# EAGLE schematic Untitled (EAGLE 7.2.0)
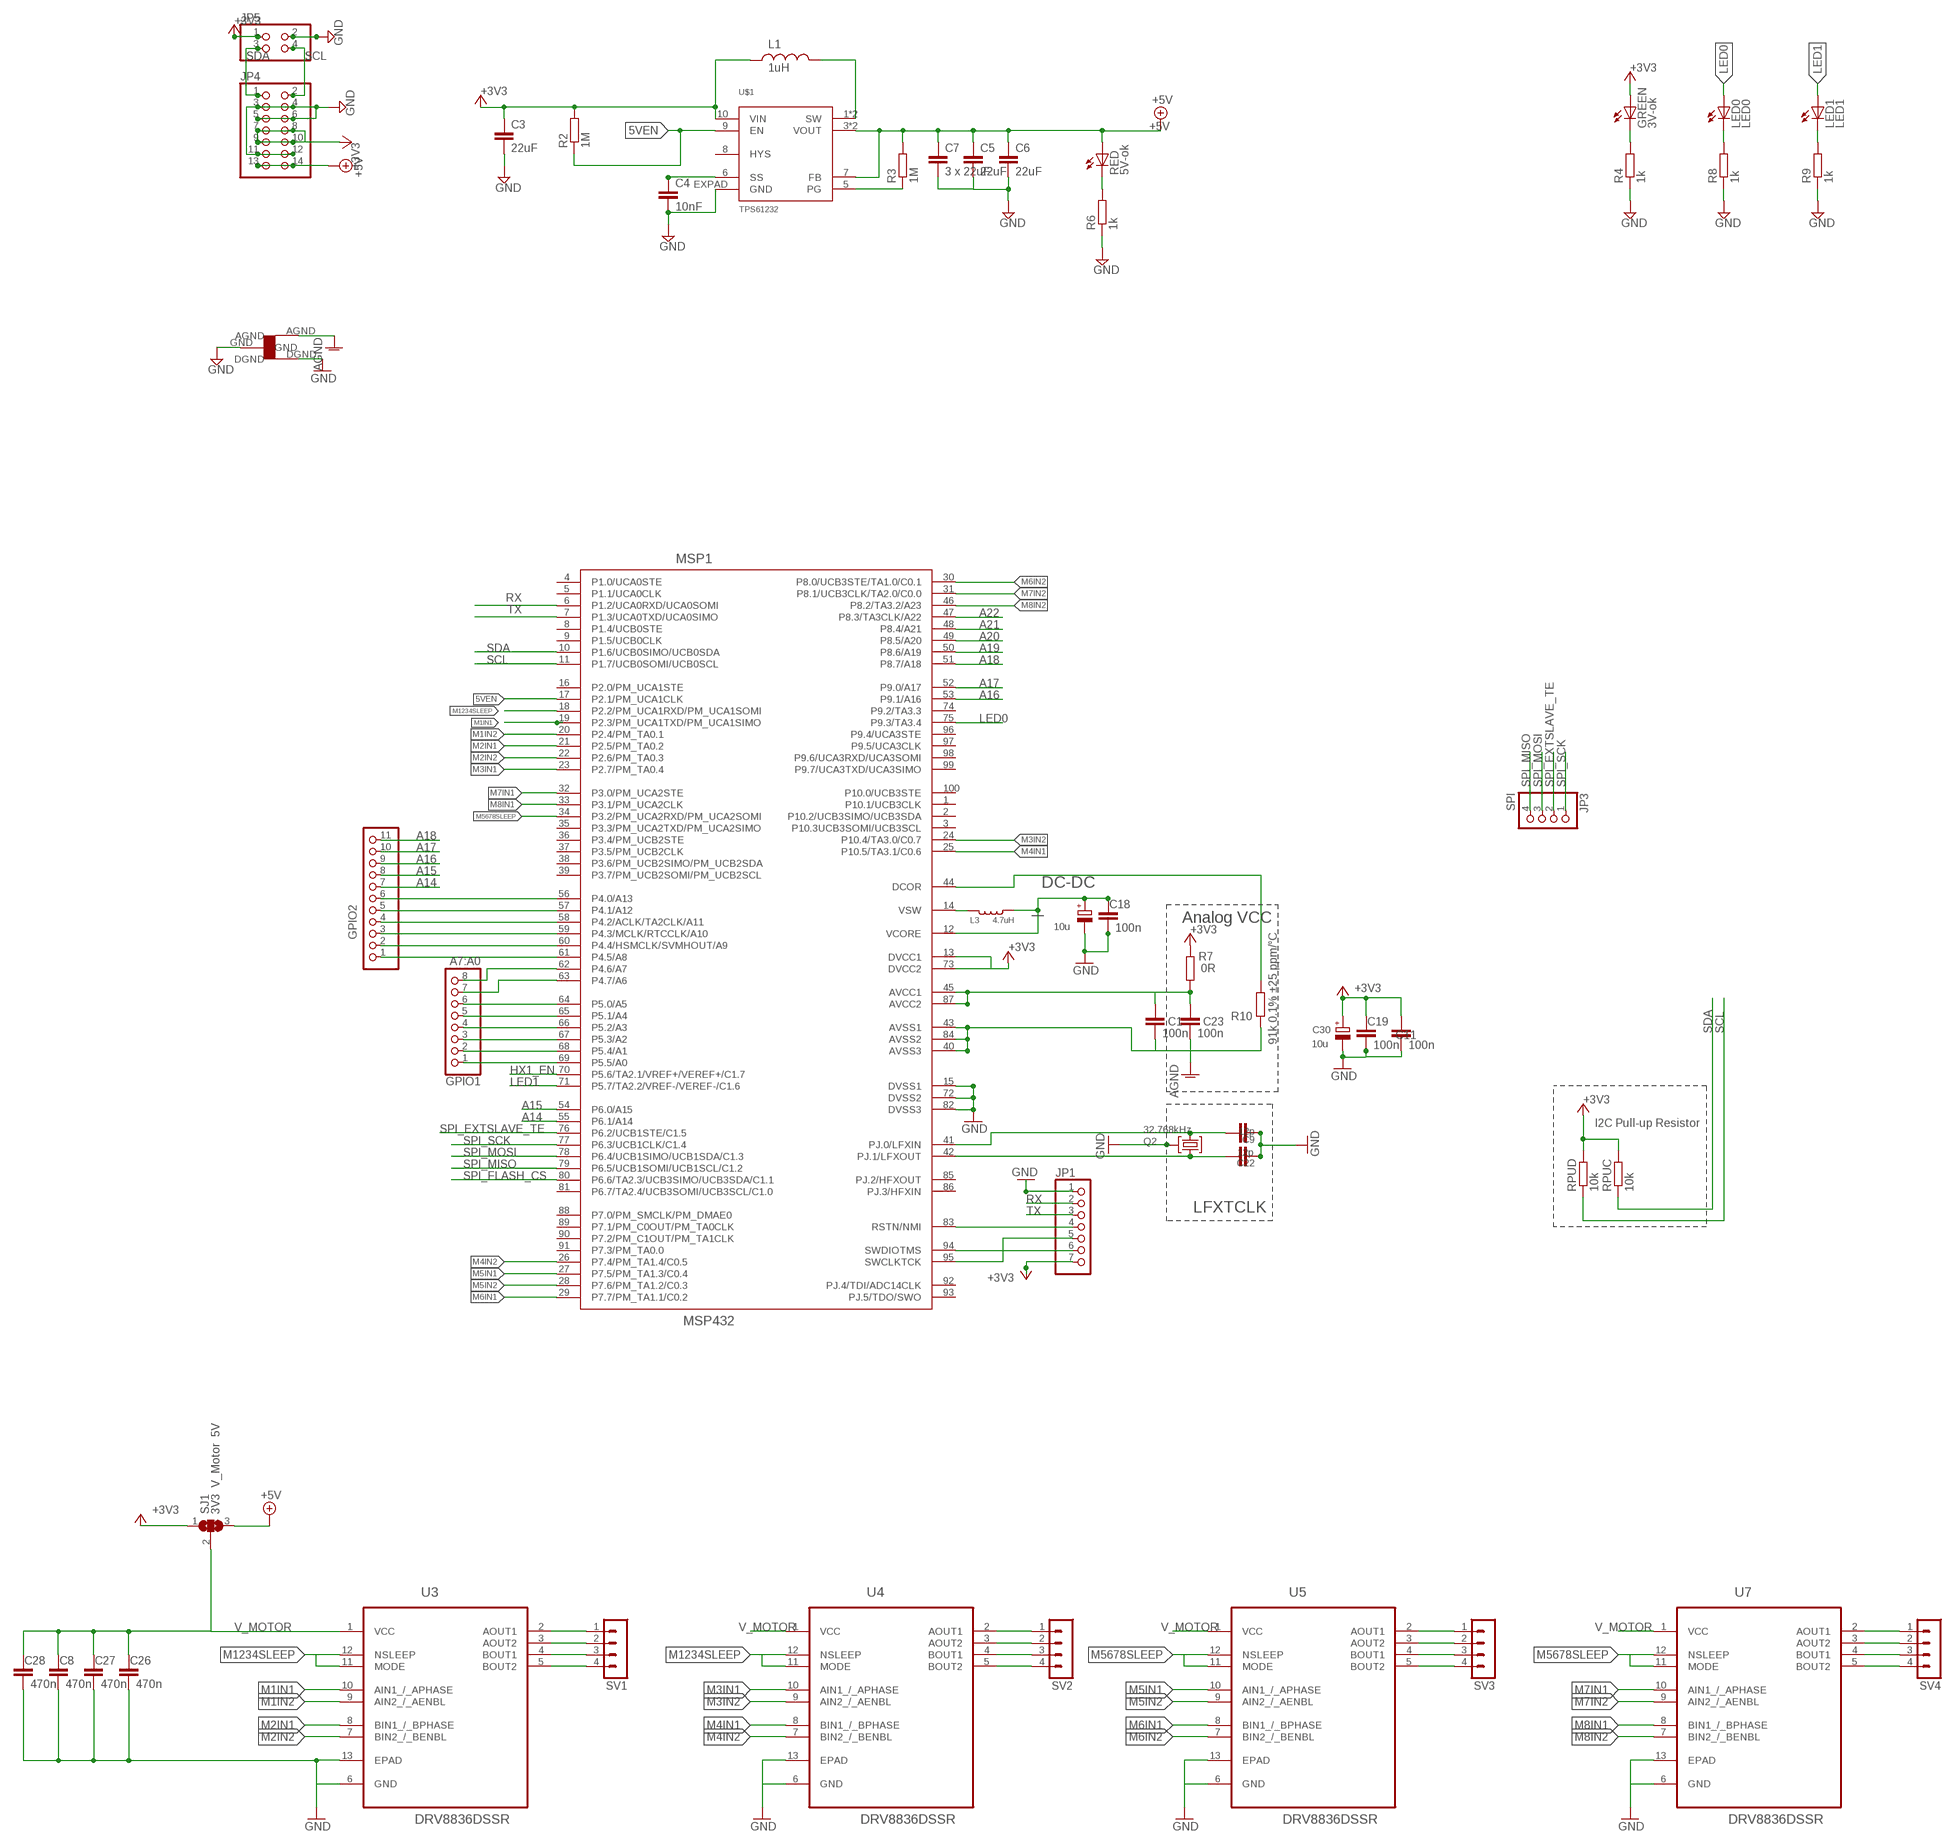
[diagram p0: schematic, sheet 1, part 1 of 2]
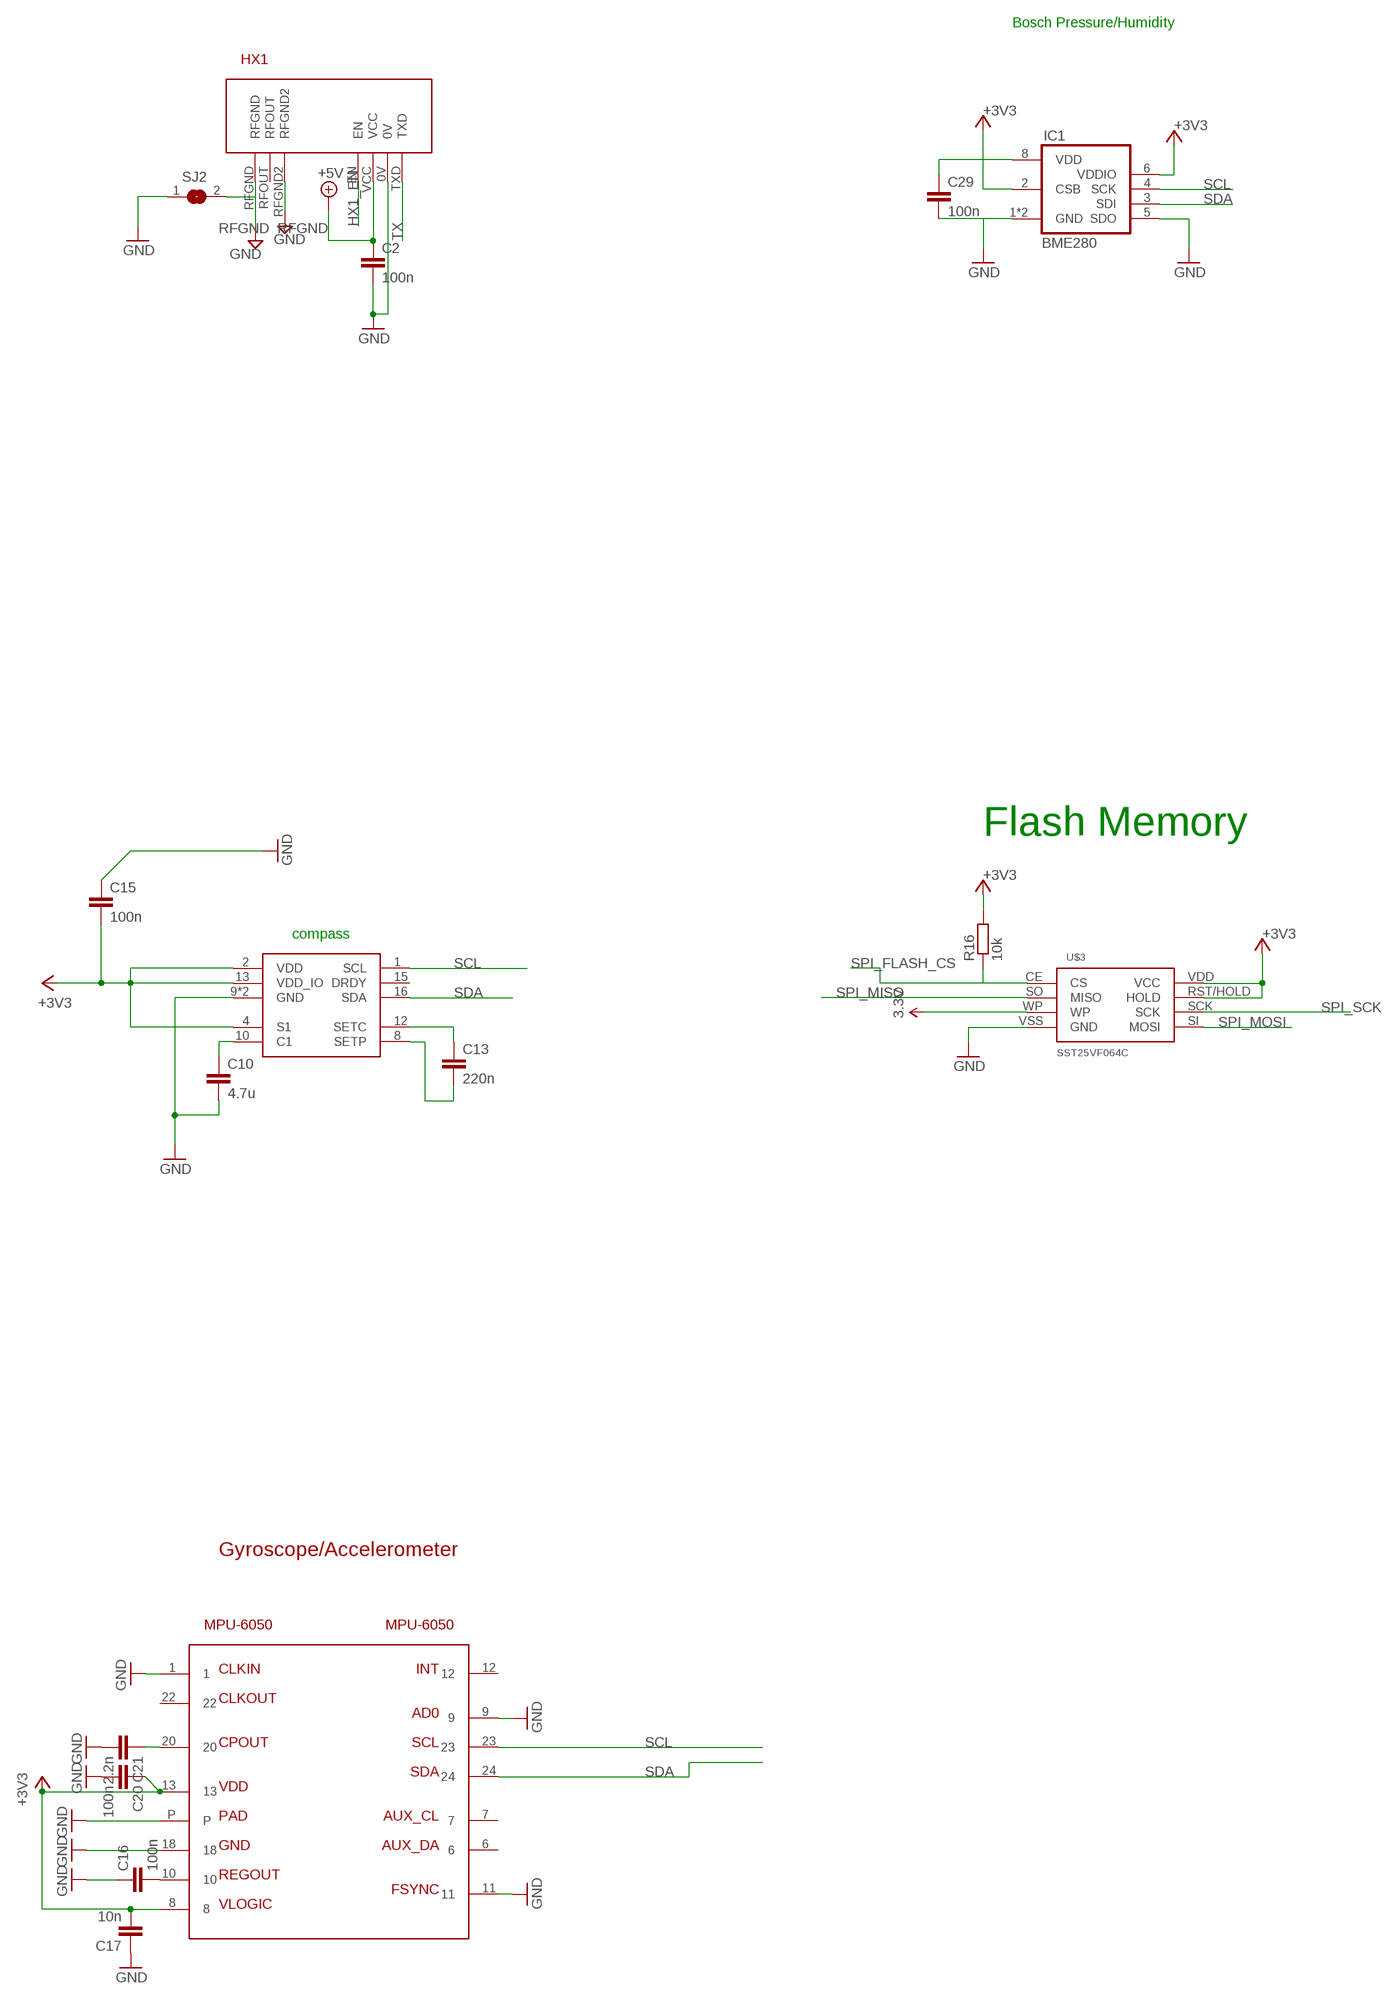
[diagram p1: schematic, sheet 1, part 2 of 2]

## Parts
C1  100n  C-EUC0402  [C0402]
C2  100n  C-EUC0603  [C0603]
C3  22uF  C-EUC0603  [C0603]
C4  10nF  C-EUC0603  [C0603]
C5  22uF  C-EUC0603  [C0603]
C6  22uF  C-EUC0603  [C0603]
C7  3 x 22uF  C-EUC0603  [C0603]
C8  470n  C-EUC0603  [C0603]
C9  12p  C-EUC0402  [C0402]
C10  4.7u  C-EUC0603  [C0603]
C11  100n  C-EUC0603  [C0603]
C13  220n  C-EUC0603  [C0603]
C15  100n  C-EUC0603  [C0603]
C16  100n  C-EUC0603  [C0603]
C17  10n  C-EUC0603  [C0603]
C18  100n  C-EUC0603  [C0603]
C19  100n  C-EUC0603  [C0603]
C20  100n  C-EUC0603  [C0603]
C21  2.2n  C-EUC0603  [C0603]
C22  12p  C-EUC0402  [C0402]
C23  100n  C-EUC0402  [C0402]
C25  10u  CPOL-EUA/3216-18R  [A/3216-18R]
C26  470n  C-EUC0603  [C0603]
C27  470n  C-EUC0603  [C0603]
C28  470n  C-EUC0603  [C0603]
C29  100n  C-EUC0603  [C0603]
C30  10u  CPOL-EUA/3216-18R  [A/3216-18R]
COMPASS  HMC5883L  HMC5883L  [LPCC16]
GPIO1  A7:A0  PINHD-1X8  [1X08]
GPIO2  A18:A8  PINHD-1X11  [1X11]
GREEN  3V-ok  LEDCHIPLED_0603  [CHIPLED_0603]
IC1  BME280  [BME280]
JP1  PINHD-1X72MM  [1:07X2MM]
JP3  SPI  PINHD-1X4  [1X04]
JP4  PINHD-2X7  [2X07]
JP5  PINHD-2X2  [2X02]
L1  1uH  XFL4020  [XFL4020]
L3  4.7uH  LQM2MP_G0  [0806]
LED0  LED0  LEDCHIPLED_0603  [CHIPLED_0603]
LED1  LED1  LEDCHIPLED_0603  [CHIPLED_0603]
MPU-6050  MPU-6050  [QFN24]
MSP1  MSP432  [PZ100]
Q2  32.768kHz  MS3V-T1R  [MS3V-T1R]
R2  1M  R-EU_R0603  [R0603]
R3  1M  R-EU_R0603  [R0603]
R4  1k  R-EU_R0603  [R0603]
R6  1k  R-EU_R0603  [R0603]
R7  0R  R-EU_R0402  [R0402]
R8  1k  R-EU_R0603  [R0603]
R9  1k  R-EU_R0603  [R0603]
R10  91k 0.1% ±25 ppm/°C  R-EU_R0402  [R0402]
R16  10k  R-EU_R0603  [R0603]
RED  5V-ok  LEDCHIPLED_0603  [CHIPLED_0603]
RPUC  10k  R-EU_R0603  [R0603]
RPUD  10k  R-EU_R0603  [R0603]
SJ1  3V3 V_Motor 5V  SJ2W  [SJ_2]
SJ2  SJ  [SJ]
SV1  MA04-1  [MA04-1]
SV2  MA04-1  [MA04-1]
SV3  MA04-1  [MA04-1]
SV4  MA04-1  [MA04-1]
U3  DRV8836DSSR  [SON50P200X300X80-13N]
U4  DRV8836DSSR  [SON50P200X300X80-13N]
U5  DRV8836DSSR  [SON50P200X300X80-13N]
U7  DRV8836DSSR  [SON50P200X300X80-13N]
U$1  TPS61232  [S-PVSON-N10]
U$2  STARGND  [STAR]
U$3  SST25VF064C  [SOIC_8-LEAD]
U$4  HX1  [HX1]

## Nets
3.3V [power]: U$3.WP
5VEN: MSP1.17(P2.1/PM_UCA1CLK) R2.1 U$1.9(EN)
+3V3 [power]: C3.1 C11.2 C15.2 C17.2 C19.2 C20.1 C29.1 C30.+ COMPASS.2(VDD) COMPASS.4(S1) COMPASS.13(VDD_IO) GREEN.A IC1.2(CSB) IC1.6(VDDIO) IC1.8(VDD) JP1.7 JP4.7 JP4.8 JP4.9 JP4.10 JP5.1 L1.P$1 MPU-6050.8 MPU-6050.13 MSP1.13(DVCC1) MSP1.73(DVCC2) R2.2 R7.2 R16.2 RPUC.2 RPUD.2 SJ1.1 U$1.10(VIN) U$3.RST/HOLD(HOLD) U$3.VDD(VCC)
+5V [fine]: C2.1 C5.1 C6.1 C7.1 JP4.13 JP4.14 R3.2 RED.A SJ1.3 U$1.3(VOUT) U$1.4(VOUT) U$1.7(FB) U$4.VCC
A14: GPIO2.7 MSP1.55(P6.1/A14)
A15: GPIO2.8 MSP1.54(P6.0/A15)
A16: GPIO2.9 MSP1.53(P9.1/A16)
A17: GPIO2.10 MSP1.52(P9.0/A17)
A18: GPIO2.11 MSP1.51(P8.7/A18)
A19: MSP1.50(P8.6/A19)
A20: MSP1.49(P8.5/A20)
A21: MSP1.48(P8.4/A21)
A22: MSP1.47(P8.3/TA3CLK/A22)
AGND [power]: C1.2 C23.2 MSP1.40(AVSS3) MSP1.43(AVSS1) MSP1.84(AVSS2) R10.2 U$2.AGND
AVCC1 [VIN]: C1.1 C23.1 MSP1.45(AVCC1) MSP1.87(AVCC2) R7.1
GND [power]: C2.2 C3.2 C4.2 C5.2 C6.2 C7.2 C8.1 C9.1 C10.2 C11.1 C15.1 C16.1 C17.1 C18.1 C19.1 C20.2 C21.2 C22.1 C25.- C26.1 C27.1 C28.1 C29.2 C30.- COMPASS.9(GND) COMPASS.11(GND) IC1.1(GND) IC1.5(SDO) IC1.7(GND) JP1.1 JP4.3 JP4.4 JP4.5 JP4.6 JP4.11 JP4.12 JP5.2 MPU-6050.1 MPU-6050.9 MPU-6050.11 MPU-6050.18 MPU-6050.P MSP1.15(DVSS1) MSP1.72(DVSS2) MSP1.82(DVSS3) Q2.P3(GND) R4.1 R6.1 R8.1 R9.1 SJ2.1 U3.6(GND) U3.13(EPAD) U4.6(GND) U4.13(EPAD) U5.6(GND) U5.13(EPAD) U7.6(GND) U7.13(EPAD) U$1.EXPAD(GND) U$2.DGND U$2.GND U$3.VSS(GND) U$4.0V
HX1_EN: MSP1.70(P5.6/TA2.1/VREF+/VEREF+/C1.7) U$4.EN
IND: L1.P$2 U$1.1(SW) U$1.2(SW)
LED0: LED0.A MSP1.75(P9.3/TA3.4)
LED1: LED1.A MSP1.71(P5.7/TA2.2/VREF-/VEREF-/C1.6)
M1IN1: MSP1.19(P2.3/PM_UCA1TXD/PM_UCA1SIMO) U3.10(AIN1_/_APHASE)
M1IN2: MSP1.20(P2.4/PM_TA0.1) U3.9(AIN2_/_AENBL)
M2IN1: MSP1.21(P2.5/PM_TA0.2) U3.8(BIN1_/_BPHASE)
M2IN2: MSP1.22(P2.6/PM_TA0.3) U3.7(BIN2_/_BENBL)
M3IN1: MSP1.23(P2.7/PM_TA0.4) U4.10(AIN1_/_APHASE)
M3IN2: MSP1.24(P10.4/TA3.0/C0.7) U4.9(AIN2_/_AENBL)
M4IN1: MSP1.25(P10.5/TA3.1/C0.6) U4.8(BIN1_/_BPHASE)
M4IN2: MSP1.26(P7.4/PM_TA1.4/C0.5) U4.7(BIN2_/_BENBL)
M5IN1: MSP1.27(P7.5/PM_TA1.3/C0.4) U5.10(AIN1_/_APHASE)
M5IN2: MSP1.28(P7.6/PM_TA1.2/C0.3) U5.9(AIN2_/_AENBL)
M6IN1: MSP1.29(P7.7/PM_TA1.1/C0.2) U5.8(BIN1_/_BPHASE)
M6IN2: MSP1.30(P8.0/UCB3STE/TA1.0/C0.1) U5.7(BIN2_/_BENBL)
M7IN1: MSP1.32(P3.0/PM_UCA2STE) U7.10(AIN1_/_APHASE)
M7IN2: MSP1.31(P8.1/UCB3CLK/TA2.0/C0.0) U7.9(AIN2_/_AENBL)
M8IN1: MSP1.33(P3.1/PM_UCA2CLK) U7.8(BIN1_/_BPHASE)
M8IN2: MSP1.46(P8.2/TA3.2/A23) U7.7(BIN2_/_BENBL)
M1234SLEEP: MSP1.18(P2.2/PM_UCA1RXD/PM_UCA1SOMI) U3.11(MODE) U3.12(NSLEEP) U4.11(MODE) U4.12(NSLEEP)
M5678SLEEP: MSP1.34(P3.2/PM_UCA2RXD/PM_UCA2SOMI) U5.11(MODE) U5.12(NSLEEP) U7.11(MODE) U7.12(NSLEEP)
N$1: C18.2 C25.+ L3.1 MSP1.12(VCORE)
N$2: R3.1 U$1.5(PG)
N$4: GREEN.C R4.2
N$5: LED0.C R8.2
N$6: LED1.C R9.2
N$8: C22.2 MSP1.41(PJ.0/LFXIN) Q2.P2
N$10: C9.2 MSP1.42(PJ.1/LFXOUT) Q2.P1
N$13: SV2.1 U4.2(AOUT1)
N$14: GPIO2.1 MSP1.61(P4.5/A8)
N$15: GPIO2.2 MSP1.60(P4.4/HSMCLK/SVMHOUT/A9)
N$17: C10.1 COMPASS.10(C1)
N$18: C16.2 MPU-6050.10
N$19: C21.1 MPU-6050.20
N$20: GPIO2.3 MSP1.59(P4.3/MCLK/RTCCLK/A10)
N$21: GPIO2.4 MSP1.58(P4.2/ACLK/TA2CLK/A11)
N$22: GPIO2.5 MSP1.57(P4.1/A12)
N$23: GPIO2.6 MSP1.56(P4.0/A13)
N$25: C13.2 COMPASS.8(SETP)
N$27: GPIO1.1 MSP1.69(P5.5/A0)
N$28: GPIO1.2 MSP1.68(P5.4/A1)
N$30: GPIO1.3 MSP1.67(P5.3/A2)
N$32: C13.1 COMPASS.12(SETC)
N$33: MSP1.44(DCOR) R10.1
N$34: L3.2 MSP1.14(VSW)
N$35: GPIO1.4 MSP1.66(P5.2/A3)
N$36: GPIO1.5 MSP1.65(P5.1/A4)
N$37: GPIO1.6 MSP1.64(P5.0/A5)
N$38: GPIO1.8 MSP1.62(P4.6/A7)
N$39: SV2.2 U4.3(AOUT2)
N$40: SV2.3 U4.4(BOUT1)
N$41: SV2.4 U4.5(BOUT2)
N$42: C4.1 U$1.6(SS)
N$43: GPIO1.7 MSP1.63(P4.7/A6)
N$44: R6.2 RED.C
N$45: SV3.1 U5.2(AOUT1)
N$46: SV3.2 U5.3(AOUT2)
N$47: SV3.3 U5.4(BOUT1)
N$48: SV3.4 U5.5(BOUT2)
N$49: SV1.1 U3.2(AOUT1)
N$50: SV1.2 U3.3(AOUT2)
N$51: SV1.3 U3.4(BOUT1)
N$52: SV1.4 U3.5(BOUT2)
N$53: SV4.1 U7.2(AOUT1)
N$54: SV4.2 U7.3(AOUT2)
N$55: SV4.3 U7.4(BOUT1)
N$56: SV4.4 U7.5(BOUT2)
N$75: JP1.4 MSP1.83(RSTN/NMI)
N$76: JP1.6 MSP1.94(SWDIOTMS)
N$77: JP1.5 MSP1.95(SWCLKTCK)
RFGND [power]: SJ2.2 U$4.RFGND U$4.RFGND2 ; supply symbol labelled GND
RX: JP1.2 MSP1.6(P1.2/UCA0RXD/UCA0SOMI)
SCL: COMPASS.1(SCL) IC1.4(SCK) JP4.2 JP5.4 MPU-6050.23 MSP1.11(P1.7/UCB0SOMI/UCB0SCL) RPUD.1
SDA: COMPASS.16(SDA) IC1.3(SDI) JP4.1 JP5.3 MPU-6050.24 MSP1.10(P1.6/UCB0SIMO/UCB0SDA) RPUC.1
SPI_EXTSLAVE_TE: JP3.2 MSP1.76(P6.2/UCB1STE/C1.5)
SPI_FLASH_CS: MSP1.80(P6.6/TA2.3/UCB3SIMO/UCB3SDA/C1.1) R16.1 U$3.CE(CS)
SPI_MISO: JP3.4 MSP1.79(P6.5/UCB1SOMI/UCB1SCL/C1.2) U$3.SO(MISO)
SPI_MOSI: JP3.3 MSP1.78(P6.4/UCB1SIMO/UCB1SDA/C1.3) U$3.SI(MOSI)
SPI_SCK: JP3.1 MSP1.77(P6.3/UCB1CLK/C1.4) U$3.SCK
TX: JP1.3 MSP1.7(P1.3/UCA0TXD/UCA0SIMO) U$4.TXD
V_MOTOR [fine]: C8.2 C26.2 C27.2 C28.2 SJ1.2 U3.1(VCC) U4.1(VCC) U5.1(VCC) U7.1(VCC)
Unconnected: COMPASS.15(DRDY) MPU-6050.6 MPU-6050.7 MPU-6050.12 MPU-6050.22 U$1.8(HYS) U$4.RFOUT

## Notes on the sheet
- Bosch Pressure/Humidity
- Flash Memory
- compass
- DC-DC
- Analog VCC
- I2C Pull-up Resistor
- LFXTCLK
- Gyroscope/Accelerometer

## Power pins joined to a net without a drawn wire
P1.0/UCA0STE: MSP1.4(P1.0/UCA0STE)
P1.1/UCA0CLK: MSP1.5(P1.1/UCA0CLK)
P1.4/UCB0STE: MSP1.8(P1.4/UCB0STE)
P1.5/UCB0CLK: MSP1.9(P1.5/UCB0CLK)
P2.0/PM_UCA1STE: MSP1.16(P2.0/PM_UCA1STE)
P3.3/PM_UCA2TXD/PM_UCA2SIMO: MSP1.35(P3.3/PM_UCA2TXD/PM_UCA2SIMO)
P3.4/PM_UCB2STE: MSP1.36(P3.4/PM_UCB2STE)
P3.5/PM_UCB2CLK: MSP1.37(P3.5/PM_UCB2CLK)
P3.6/PM_UCB2SIMO/PM_UCB2SDA: MSP1.38(P3.6/PM_UCB2SIMO/PM_UCB2SDA)
P3.7/PM_UCB2SOMI/PM_UCB2SCL: MSP1.39(P3.7/PM_UCB2SOMI/PM_UCB2SCL)
P6.7/TA2.4/UCB3SOMI/UCB3SCL/C1.0: MSP1.81(P6.7/TA2.4/UCB3SOMI/UCB3SCL/C1.0)
P7.0/PM_SMCLK/PM_DMAE0: MSP1.88(P7.0/PM_SMCLK/PM_DMAE0)
P7.1/PM_C0OUT/PM_TA0CLK: MSP1.89(P7.1/PM_C0OUT/PM_TA0CLK)
P7.2/PM_C1OUT/PM_TA1CLK: MSP1.90(P7.2/PM_C1OUT/PM_TA1CLK)
P7.3/PM_TA0.0: MSP1.91(P7.3/PM_TA0.0)
P9.2/TA3.3: MSP1.74(P9.2/TA3.3)
P9.4/UCA3STE: MSP1.96(P9.4/UCA3STE)
P9.5/UCA3CLK: MSP1.97(P9.5/UCA3CLK)
P9.6/UCA3RXD/UCA3SOMI: MSP1.98(P9.6/UCA3RXD/UCA3SOMI)
P9.7/UCA3TXD/UCA3SIMO: MSP1.99(P9.7/UCA3TXD/UCA3SIMO)
P10.0/UCB3STE: MSP1.100(P10.0/UCB3STE)
P10.1/UCB3CLK: MSP1.1(P10.1/UCB3CLK)
P10.2/UCB3SIMO/UCB3SDA: MSP1.2(P10.2/UCB3SIMO/UCB3SDA)
P10.3UCB3SOMI/UCB3SCL: MSP1.3(P10.3UCB3SOMI/UCB3SCL)
PJ.2/HFXOUT: MSP1.85(PJ.2/HFXOUT)
PJ.3/HFXIN: MSP1.86(PJ.3/HFXIN)
PJ.4/TDI/ADC14CLK: MSP1.92(PJ.4/TDI/ADC14CLK)
PJ.5/TDO/SWO: MSP1.93(PJ.5/TDO/SWO)

## Library data of the parts
C1-C11 C13 C15-C23 C26-C29 = rcl:C-EU: CAPACITOR, European symbol
C25 C30 = rcl:CPOL-EU: POLARIZED CAPACITOR, European symbol
COMPASS = HMC5883L:HMC5883L
GPIO1 = pinhead:PINHD-1X8: PIN HEADER
GPIO2 = pinhead:PINHD-1X11: PIN HEADER
GREEN LED0 LED1 RED = adafruit:LED: LED OSRAM: - CHIPLED LG R971, LG N971, LY N971, LG Q971, LY Q971, LO R971, LY R971 LH N974, LH R974 LS Q976, LO Q976, LY Q976 LO Q996 - Hyper CHIPLED LW Q18S LB Q993, LB Q99A, LB R99A - SideLED LS A670, LO A670, LY A670, LG A670, LP A670 LB A673, LV A673, LT A673, LW A673 LH A674 LY A675 LS A676, LA A676, LO A676, LY A676, LW A676 LS A679, LY A679, LG A679 - Hyper Micro SIDELED® LS Y876, LA Y876, LO Y876, LY Y876 LT Y87S - SmartLED LW L88C, LW L88S LB L89C, LB L89S, LG L890 LS L89K, LO L89K, LY L89K LS L896, LA L896, LO L896, LY L896 - TOPLED LS T670, LO T670, LY T670, LG T670, LP T670 LSG T670, LSP T670, LSY T670, LOP T670, LYG T670 LG T671, LOG T671, LSG T671 LB T673, LV T673, LT T673, LW T673 LH T674 LS T676, LA T676, LO T676, LY T676, LB T676, LH T676, LSB T676, LW T676 LB T67C, LV T67C, LT T67C, LS T67K, LO T67K, LY T67K, LW E67C LS E67B, LA E67B, LO E67B, LY E67B, LB E67C, LV E67C, LT E67C LW T67C LS T679, LY T679, LG T679 LS T770, LO T770, LY T770, LG T770, LP T770 LB T773, LV T773, LT T773, LW T773 LH T774 LS E675, LA E675, LY E675, LS T675 LS T776, LA T776, LO T776, LY T776, LB T776 LHGB T686 LT T68C, LB T68C - Hyper Mini TOPLED® LB M676 - Mini TOPLED Santana® LG M470 LS M47K, LO M47K, LY M47K Source: http://www.osram.convergy.de/
IC1 = bosch-bme280:BME280: DIGITAL HUMIDITY, PRESSURE AND TEMPERATURE SENSOR * Digital interface I²C (up to 3.4 MHz) and SPI (3 and 4 wire, up to 10 MHz)* Supply voltage VDD main supply voltage range: 1.71 V to 3.6 V*VDDIO interface voltage range: 1.2 V to 3.6 V Operating range -40…+85 °C, 0…100 % rel. humidity, 300…1100 hPa The library has been designed by Richard Magdycz <https://www.facebook.com/groups/eaglecadsoftUK>
JP1 = Headerlibrary:PINHD-1X7: PIN HEADER
JP3 = pinhead:PINHD-1X4: PIN HEADER
JP4 = pinhead:PINHD-2X7: PIN HEADER
JP5 = pinhead:PINHD-2X2: PIN HEADER
L1 = Coilcraft:XFL4020
L3 = Murata:LQM2MP_G0
MPU-6050 = seb:MPU-6050
MSP1 = MSP-EXP432:MSP432
Q2 = microcrystal:MS3V-T1R
R2-R4 R6-R10 R16 RPUC RPUD = rcl:R-EU_: RESISTOR, European symbol
SJ1 = jumper:SJ2W: SMD solder JUMPER
SJ2 = jumper:SJ: SMD solder JUMPER
SV1-SV4 = con-lstb:MA04-1: PIN HEADER; OC_FARNELL: unknown; OC_NEWARK: unknown
U3-U5 U7 = DRV8834:DRV8836DSSR: DUAL LOW VOLTAGE H-BRIDGE IC,SON-12; MPN: DRV8836DSSR; OC_FARNELL: 2115236; OC_NEWARK: 94T6066; PACKAGE: SON-12; SUPPLIER: TEXAS INSTRUMENTS
U$1 = texasinstruments:TPS61232: Up to 96% Efficiency Synchronous Boost Converter 3.3 V to 5 V Power Conversion with 2.1 A Output Current Input Supply Voltage Supervisor with Adjustable Threshold/ Hysteresis Power Save Mode for Light Load Efficiency Load Disconnect During Shutdown Output Over Voltage Protection Programmable Soft Start Power Good Output Input Voltage Range: 2.3 V to 5.5 V Output Voltage Range: 2.5 V to 5.5 V 2 MHz Switching Frequency Output Capacitor Discharge (TPS61231) 3 mm × 3 mm × 0.9 mm SON Package
U$2 = lpatiny:STARGND
U$3 = BertaLib:SST25VF064C
U$4 = Octanis1:HX1: Radiometrix HX1: VHF Narrow Band FM 300mW Transmitter. HX1-144.390-3

## Net classes
0 default: width 0.254 mm
1 power: width 0.203 mm, drill 0.305 mm, clearance 0.152 mm
2 VIN: width 0.203 mm, drill 0.305 mm, clearance 0.152 mm
3 fine: width 0.406 mm, drill 0.61 mm, clearance 0.152 mm